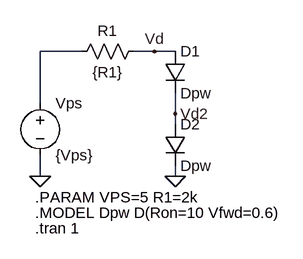
[diagram p0: schematic 6-9-a-1.asc]
6-9-a-1.asc, the LTspice schematic file:
Version 4
SHEET 1 880 680
WIRE 160 80 96 80
WIRE 272 80 240 80
WIRE 304 80 272 80
WIRE 96 160 96 80
WIRE 304 176 304 144
WIRE 304 192 304 176
WIRE 96 272 96 240
WIRE 304 272 304 256
FLAG 304 272 0
FLAG 96 272 0
FLAG 272 80 Vd
FLAG 304 176 Vd2
SYMBOL voltage 96 144 R0
SYMATTR InstName Vps
SYMATTR Value {Vps}
SYMBOL res 256 64 R90
WINDOW 0 0 56 VBottom 2
WINDOW 3 32 56 VTop 2
SYMATTR InstName R1
SYMATTR Value {R1}
SYMBOL diode 288 80 R0
SYMATTR InstName D1
SYMATTR Value Dpw
SYMBOL diode 288 192 R0
SYMATTR InstName D2
SYMATTR Value Dpw
TEXT 88 304 Left 2 !.PARAM VPS=5 R1=2k
TEXT 88 328 Left 2 !.MODEL Dpw D(Ron=10 Vfwd=0.6)
TEXT 88 352 Left 2 !.tran 1

The netlist it stands for:
* 6-9-a-1.asc
Vps N001 0 {Vps}
R1 Vd N001 {R1}
D1 Vd Vd2 Dpw
D2 Vd2 0 Dpw
.model D D
.lib standard.dio
.PARAM VPS=5 R1=2k
.MODEL Dpw D(Ron=10 Vfwd=0.6)
.tran 1
.backanno
.end

* Results of the author's LTspice run, read from the files saved beside the schematic
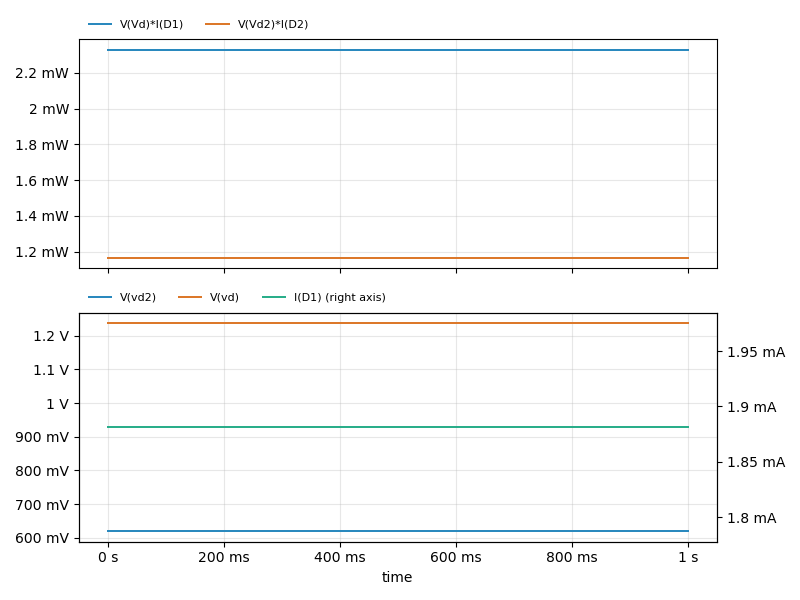
[diagram p1: Transient Analysis of 6-9-a-1.asc, plotted from the saved traces]
* Transient Analysis, 1 run:
*   V(Vd)*I(D1): min 2.328 mW, max 2.328 mW, average 2.328 mW, rms 2.328 mW, last 2.328 mW
*   V(Vd2)*I(D2): min 1.164 mW, max 1.164 mW, average 1.164 mW, rms 1.164 mW, last 1.164 mW
*   V(vd2): min 618.8 mV, max 618.8 mV, average 618.8 mV, rms 618.8 mV, last 618.8 mV
*   V(vd): min 1.238 V, max 1.238 V, average 1.238 V, rms 1.238 V, last 1.238 V
*   I(D1): min 1.881 mA, max 1.881 mA, average 1.881 mA, rms 1.881 mA, last 1.881 mA